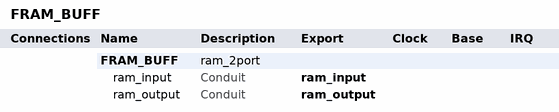
[diagram p0: system contents]
# Platform Designer (Qsys) system FRAM_BUFF, Arria 10 10AS066H1F34E1SG
# Parameters at their usual value, and those the tool derives, are not listed.
package require qsys
create_system FRAM_BUFF
set_project_property DEVICE_FAMILY {Arria 10}
set_project_property DEVICE 10AS066H1F34E1SG

add_instance FRAM_BUFF ram_2port 15.1
set_instance_property FRAM_BUFF AUTO_EXPORT true
set_instance_parameter_value FRAM_BUFF GUI_ACLR_READ_INPUT_RDADDRESS false
set_instance_parameter_value FRAM_BUFF GUI_ACLR_READ_OUTPUT_QA false
set_instance_parameter_value FRAM_BUFF GUI_ACLR_READ_OUTPUT_QB false
set_instance_parameter_value FRAM_BUFF GUI_BLANK_MEMORY 0
set_instance_parameter_value FRAM_BUFF GUI_BYTE_ENABLE_A false
set_instance_parameter_value FRAM_BUFF GUI_BYTE_ENABLE_B false
set_instance_parameter_value FRAM_BUFF GUI_BYTE_ENABLE_WIDTH 8
set_instance_parameter_value FRAM_BUFF GUI_CLKEN_ADDRESS_STALL_A false
set_instance_parameter_value FRAM_BUFF GUI_CLKEN_ADDRESS_STALL_B false
set_instance_parameter_value FRAM_BUFF GUI_CLKEN_INPUT_REG_A false
set_instance_parameter_value FRAM_BUFF GUI_CLKEN_INPUT_REG_B false
set_instance_parameter_value FRAM_BUFF GUI_CLKEN_OUTPUT_REG_A false
set_instance_parameter_value FRAM_BUFF GUI_CLKEN_OUTPUT_REG_B false
set_instance_parameter_value FRAM_BUFF GUI_CLKEN_RDADDRESSSTALL false
set_instance_parameter_value FRAM_BUFF GUI_CLKEN_READ_INPUT_REG false
set_instance_parameter_value FRAM_BUFF GUI_CLKEN_READ_OUTPUT_REG false
set_instance_parameter_value FRAM_BUFF GUI_CLKEN_WRADDRESSSTALL false
set_instance_parameter_value FRAM_BUFF GUI_CLKEN_WRITE_INPUT_REG false
set_instance_parameter_value FRAM_BUFF GUI_CLOCK_TYPE 4
set_instance_parameter_value FRAM_BUFF GUI_COHERENT_READ false
set_instance_parameter_value FRAM_BUFF GUI_CONSTRAINED_DONT_CARE true
set_instance_parameter_value FRAM_BUFF GUI_DATAA_WIDTH 10
set_instance_parameter_value FRAM_BUFF GUI_DIFFERENT_CLKENS false
set_instance_parameter_value FRAM_BUFF GUI_ECCENCBYPASS false
set_instance_parameter_value FRAM_BUFF GUI_ECC_DOUBLE false
set_instance_parameter_value FRAM_BUFF GUI_ECC_PIPELINE false
set_instance_parameter_value FRAM_BUFF GUI_ECC_TRIPLE false
set_instance_parameter_value FRAM_BUFF GUI_FILE_REFERENCE 0
set_instance_parameter_value FRAM_BUFF GUI_INIT_FILE_LAYOUT PORT_A
set_instance_parameter_value FRAM_BUFF GUI_INIT_SIM_TO_X false
set_instance_parameter_value FRAM_BUFF GUI_LC_IMPLEMENTION_OPTIONS 0
set_instance_parameter_value FRAM_BUFF GUI_MAX_DEPTH Auto
set_instance_parameter_value FRAM_BUFF GUI_MEMSIZE_BITS 256
set_instance_parameter_value FRAM_BUFF GUI_MEMSIZE_WORDS 921600
set_instance_parameter_value FRAM_BUFF GUI_MEM_IN_BITS 0
set_instance_parameter_value FRAM_BUFF GUI_MODE 1
set_instance_parameter_value FRAM_BUFF GUI_NBE_A true
set_instance_parameter_value FRAM_BUFF GUI_NBE_B true
set_instance_parameter_value FRAM_BUFF GUI_QA_WIDTH 10
set_instance_parameter_value FRAM_BUFF GUI_QB_WIDTH 10
set_instance_parameter_value FRAM_BUFF GUI_Q_PORT_MODE 2
set_instance_parameter_value FRAM_BUFF GUI_RAM_BLOCK_TYPE Auto
set_instance_parameter_value FRAM_BUFF GUI_RDEN_DOUBLE false
set_instance_parameter_value FRAM_BUFF GUI_RDEN_SINGLE false
set_instance_parameter_value FRAM_BUFF GUI_RDW_A_MODE {New Data}
set_instance_parameter_value FRAM_BUFF GUI_RDW_B_MODE {New Data}
set_instance_parameter_value FRAM_BUFF GUI_READ_INPUT_RDADDRESS true
set_instance_parameter_value FRAM_BUFF GUI_READ_OUTPUT_QA false
set_instance_parameter_value FRAM_BUFF GUI_READ_OUTPUT_QB false
set_instance_parameter_value FRAM_BUFF GUI_SCLR_READ_OUTPUT_QA false
set_instance_parameter_value FRAM_BUFF GUI_SCLR_READ_OUTPUT_QB false
set_instance_parameter_value FRAM_BUFF GUI_VAR_WIDTH false
set_instance_parameter_value FRAM_BUFF GUI_WIDTH_ECCENCPARITY 8
set_instance_parameter_value FRAM_BUFF GUI_WRITE_INPUT_PORTS true

# exported interfaces
add_interface ram_input conduit end
set_interface_property ram_input EXPORT_OF FRAM_BUFF.ram_input
add_interface ram_output conduit end
set_interface_property ram_output EXPORT_OF FRAM_BUFF.ram_output

set_interconnect_requirement {$system} qsys_mm.clockCrossingAdapter HANDSHAKE
set_interconnect_requirement {$system} qsys_mm.enableEccProtection FALSE
set_interconnect_requirement {$system} qsys_mm.insertDefaultSlave FALSE
set_interconnect_requirement {$system} qsys_mm.maxAdditionalLatency 1

save_system FRAM_BUFF.qsys
